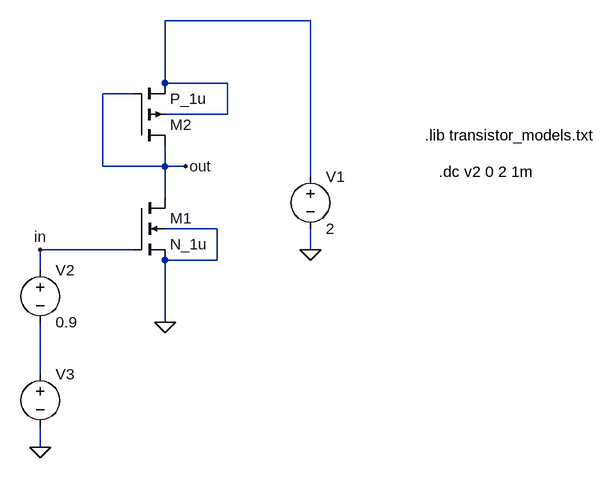
[diagram p0: schematic CS Stage - Diode-Connected Load.asc]
CS Stage - Diode-Connected Load.asc, the LTspice schematic file:
Version 4
SHEET 1 880 680
WIRE 368 -160 144 -160
WIRE 144 -64 144 -160
WIRE 240 -64 144 -64
WIRE 96 -48 48 -48
WIRE 240 -16 240 -64
WIRE 240 -16 144 -16
WIRE 48 64 48 -48
WIRE 144 64 144 32
WIRE 144 64 48 64
WIRE 176 64 144 64
WIRE 368 80 368 -160
WIRE 144 112 144 64
WIRE 224 160 144 160
WIRE 96 192 -48 192
WIRE 368 192 368 160
WIRE 224 208 224 160
WIRE 224 208 144 208
WIRE -48 224 -48 192
WIRE 144 304 144 208
WIRE -48 384 -48 304
WIRE -48 496 -48 464
FLAG 368 192 0
FLAG 144 304 0
FLAG -48 496 0
FLAG 176 64 out
FLAG -48 192 in
SYMBOL nmos4 96 112 R0
SYMATTR InstName M1
SYMATTR Value N_1u
SYMATTR Value2 l=10u w=100u
SYMBOL voltage 368 64 R0
WINDOW 123 0 0 Left 0
WINDOW 39 0 0 Left 0
SYMATTR InstName V1
SYMATTR Value 2
SYMBOL pmos4 96 32 M180
SYMATTR InstName M2
SYMATTR Value P_1u
SYMATTR Value2 l=1u w=10u
SYMBOL voltage -48 208 R0
WINDOW 123 0 0 Left 0
WINDOW 39 0 0 Left 0
SYMATTR InstName V2
SYMATTR Value 0.9
SYMBOL voltage -48 368 R0
WINDOW 123 0 0 Left 0
WINDOW 39 0 0 Left 0
SYMATTR InstName V3
SYMATTR Value ""
TEXT 544 16 Left 2 !.lib transistor_models.txt
TEXT 566 72 Left 2 !.dc v2 0 2 1m

The netlist it stands for:
* CS Stage - Diode-Connected Load.asc
M1 out in 0 0 N_1u l=10u w=100u
V1 N001 0 2
M2 out out N001 N001 P_1u l=1u w=10u
V2 in N002 0.9
V3 N002 0
.model NMOS NMOS
.model PMOS PMOS
.lib standard.mos
.lib transistor_models.txt
.dc v2 0 2 1m
.backanno
.end